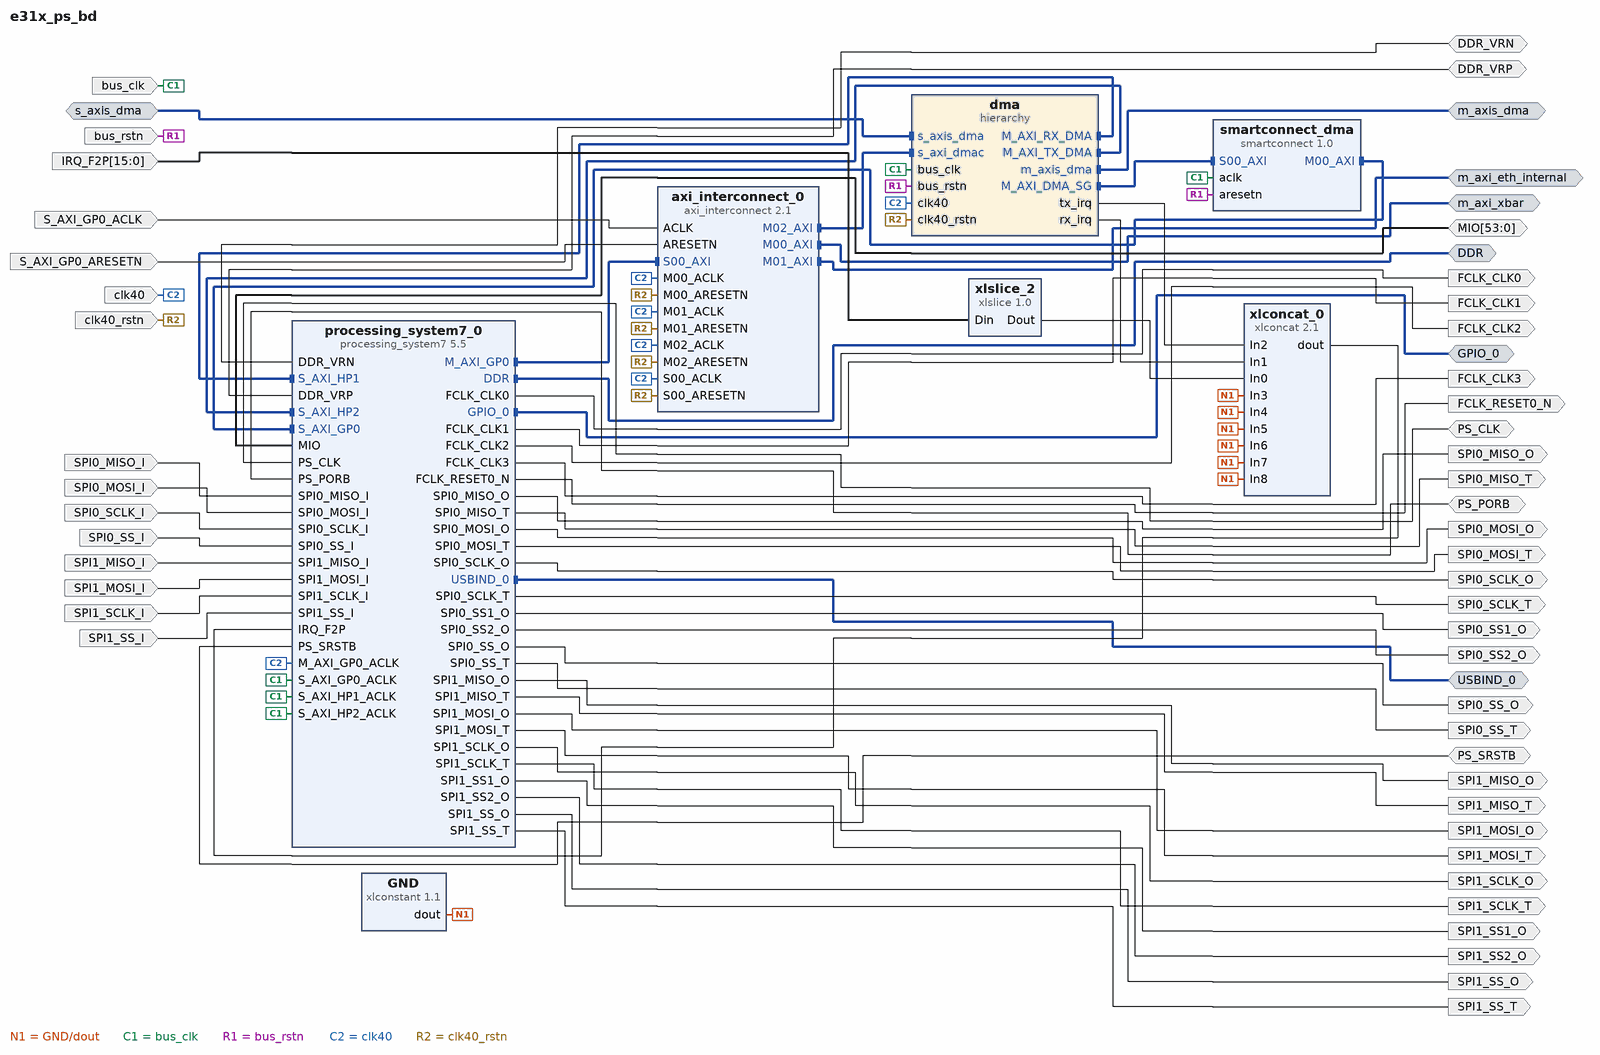
[diagram p0: block diagram of the top level]
# Vivado block design e31x_ps_bd, xc7z020clg400-2, Vivado 2022.2
create_bd_design e31x_ps_bd

create_bd_intf_port -mode Master -vlnv xilinx.com:interface:ddrx_rtl:1.0 DDR
create_bd_intf_port -mode Master -vlnv xilinx.com:interface:gpio_rtl:1.0 GPIO_0
create_bd_intf_port -mode Master -vlnv xilinx.com:display_processing_system7:usbctrl_rtl:1.0 USBIND_0
create_bd_intf_port -mode Master -vlnv xilinx.com:interface:aximm_rtl:1.0 m_axi_eth_internal
set_property -dict [list \
  CONFIG.ADDR_WIDTH 31 \
  CONFIG.DATA_WIDTH 32 \
  CONFIG.FREQ_HZ 40000000 \
  CONFIG.HAS_BURST 0 \
  CONFIG.HAS_CACHE 0 \
  CONFIG.HAS_LOCK 0 \
  CONFIG.HAS_PROT 0 \
  CONFIG.HAS_QOS 0 \
  CONFIG.HAS_WSTRB 0 \
  CONFIG.NUM_READ_OUTSTANDING 2 \
  CONFIG.NUM_WRITE_OUTSTANDING 2 \
  CONFIG.PROTOCOL AXI4LITE \
] [get_bd_intf_ports m_axi_eth_internal]
create_bd_intf_port -mode Master -vlnv xilinx.com:interface:aximm_rtl:1.0 m_axi_xbar
set_property -dict [list \
  CONFIG.ADDR_WIDTH 32 \
  CONFIG.DATA_WIDTH 32 \
  CONFIG.FREQ_HZ 40000000 \
  CONFIG.HAS_BURST 0 \
  CONFIG.HAS_CACHE 0 \
  CONFIG.HAS_LOCK 0 \
  CONFIG.HAS_PROT 0 \
  CONFIG.HAS_QOS 0 \
  CONFIG.HAS_WSTRB 0 \
  CONFIG.NUM_READ_OUTSTANDING 2 \
  CONFIG.NUM_WRITE_OUTSTANDING 2 \
  CONFIG.PROTOCOL AXI4LITE \
] [get_bd_intf_ports m_axi_xbar]
create_bd_intf_port -mode Master -vlnv xilinx.com:interface:axis_rtl:1.0 m_axis_dma
set_property -dict {CONFIG.FREQ_HZ 200000000} [get_bd_intf_ports m_axis_dma]
create_bd_intf_port -mode Slave -vlnv xilinx.com:interface:axis_rtl:1.0 s_axis_dma
set_property -dict [list \
  CONFIG.FREQ_HZ 200000000 \
  CONFIG.HAS_TKEEP 0 \
  CONFIG.HAS_TLAST 1 \
  CONFIG.HAS_TREADY 1 \
  CONFIG.HAS_TSTRB 0 \
  CONFIG.LAYERED_METADATA undef \
  CONFIG.TDATA_NUM_BYTES 8 \
  CONFIG.TDEST_WIDTH 4 \
  CONFIG.TID_WIDTH 0 \
  CONFIG.TUSER_WIDTH 0 \
] [get_bd_intf_ports s_axis_dma]
create_bd_port -dir IO DDR_VRN
create_bd_port -dir IO DDR_VRP
create_bd_port -dir O -type clk FCLK_CLK0
create_bd_port -dir O -type clk FCLK_CLK1
create_bd_port -dir O -type clk FCLK_CLK2
create_bd_port -dir O -type clk FCLK_CLK3
create_bd_port -dir O -type rst FCLK_RESET0_N
create_bd_port -dir I -from 15 -to 0 -type intr IRQ_F2P
set_property -dict {CONFIG.PortWidth 16 CONFIG.SENSITIVITY EDGE_RISING} [get_bd_ports IRQ_F2P]
create_bd_port -dir IO -from 53 -to 0 MIO
create_bd_port -dir IO PS_CLK
create_bd_port -dir IO PS_PORB
create_bd_port -dir IO PS_SRSTB
create_bd_port -dir I SPI0_MISO_I
create_bd_port -dir O SPI0_MISO_O
create_bd_port -dir O SPI0_MISO_T
create_bd_port -dir I SPI0_MOSI_I
create_bd_port -dir O SPI0_MOSI_O
create_bd_port -dir O SPI0_MOSI_T
create_bd_port -dir I SPI0_SCLK_I
create_bd_port -dir O SPI0_SCLK_O
create_bd_port -dir O SPI0_SCLK_T
create_bd_port -dir O SPI0_SS1_O
create_bd_port -dir O SPI0_SS2_O
create_bd_port -dir I SPI0_SS_I
create_bd_port -dir O SPI0_SS_O
create_bd_port -dir O SPI0_SS_T
create_bd_port -dir I SPI1_MISO_I
create_bd_port -dir O SPI1_MISO_O
create_bd_port -dir O SPI1_MISO_T
create_bd_port -dir I SPI1_MOSI_I
create_bd_port -dir O SPI1_MOSI_O
create_bd_port -dir O SPI1_MOSI_T
create_bd_port -dir I SPI1_SCLK_I
create_bd_port -dir O SPI1_SCLK_O
create_bd_port -dir O SPI1_SCLK_T
create_bd_port -dir O SPI1_SS1_O
create_bd_port -dir O SPI1_SS2_O
create_bd_port -dir I SPI1_SS_I
create_bd_port -dir O SPI1_SS_O
create_bd_port -dir O SPI1_SS_T
create_bd_port -dir I -type clk S_AXI_GP0_ACLK
set_property -dict {CONFIG.ASSOCIATED_RESET S_AXI_GP0_ARESETN CONFIG.FREQ_HZ 40000000} [get_bd_ports S_AXI_GP0_ACLK]
create_bd_port -dir I -type rst S_AXI_GP0_ARESETN
create_bd_port -dir I -type clk bus_clk
set_property -dict [list \
  CONFIG.ASSOCIATED_BUSIF m_axis_dma:s_axis_dma \
  CONFIG.ASSOCIATED_RESET bus_rstn \
  CONFIG.FREQ_HZ 200000000 \
] [get_bd_ports bus_clk]
create_bd_port -dir I -type rst bus_rstn
create_bd_port -dir I -type clk clk40
set_property -dict [list \
  CONFIG.ASSOCIATED_BUSIF m_axi_xbar:m_axi_eth_internal \
  CONFIG.ASSOCIATED_RESET clk40_rstn \
  CONFIG.FREQ_HZ 40000000 \
] [get_bd_ports clk40]
create_bd_port -dir I -type rst clk40_rstn

create_bd_cell -type hier dma
create_bd_cell -type ip -vlnv xilinx.com:ip:axi_interconnect:2.1 axi_interconnect_0
set_property -dict {CONFIG.ENABLE_ADVANCED_OPTIONS 0 CONFIG.NUM_MI 3} [get_bd_cells axi_interconnect_0]
create_bd_cell -type ip -vlnv xilinx.com:ip:processing_system7:5.5 processing_system7_0
set_property -dict [list \
  CONFIG.PCW_APU_PERIPHERAL_FREQMHZ 1000 \
  CONFIG.PCW_CPU_CPU_6X4X_MAX_RANGE 767 \
  CONFIG.PCW_ENET0_ENET0_IO {MIO 16 .. 27} \
  CONFIG.PCW_ENET0_GRP_MDIO_ENABLE 1 \
  CONFIG.PCW_ENET0_GRP_MDIO_IO {MIO 52 .. 53} \
  CONFIG.PCW_ENET0_PERIPHERAL_ENABLE 1 \
  CONFIG.PCW_ENET0_RESET_ENABLE 0 \
  CONFIG.PCW_ENET_RESET_ENABLE 1 \
  CONFIG.PCW_ENET_RESET_SELECT {Share reset pin} \
  CONFIG.PCW_EN_CLK1_PORT 1 \
  CONFIG.PCW_EN_CLK2_PORT 1 \
  CONFIG.PCW_EN_CLK3_PORT 1 \
  CONFIG.PCW_FCLK_CLK1_BUF TRUE \
  CONFIG.PCW_FCLK_CLK2_BUF TRUE \
  CONFIG.PCW_FCLK_CLK3_BUF TRUE \
  CONFIG.PCW_FPGA0_PERIPHERAL_FREQMHZ 100 \
  CONFIG.PCW_FPGA1_PERIPHERAL_FREQMHZ 40 \
  CONFIG.PCW_FPGA2_PERIPHERAL_FREQMHZ 166.6667 \
  CONFIG.PCW_FPGA3_PERIPHERAL_FREQMHZ 200 \
  CONFIG.PCW_FPGA_FCLK1_ENABLE 1 \
  CONFIG.PCW_FPGA_FCLK2_ENABLE 1 \
  CONFIG.PCW_FPGA_FCLK3_ENABLE 1 \
  CONFIG.PCW_GPIO_EMIO_GPIO_ENABLE 1 \
  CONFIG.PCW_GPIO_EMIO_GPIO_IO 64 \
  CONFIG.PCW_GPIO_MIO_GPIO_ENABLE 1 \
  CONFIG.PCW_GPIO_MIO_GPIO_IO MIO \
  CONFIG.PCW_I2C0_I2C0_IO EMIO \
  CONFIG.PCW_I2C0_PERIPHERAL_ENABLE 1 \
  CONFIG.PCW_I2C_PERIPHERAL_FREQMHZ 127.777779 \
  CONFIG.PCW_I2C_RESET_ENABLE 0 \
  CONFIG.PCW_IRQ_F2P_INTR 1 \
  CONFIG.PCW_PERIPHERAL_BOARD_PRESET None \
  CONFIG.PCW_PRESET_BANK1_VOLTAGE {LVCMOS 1.8V} \
  CONFIG.PCW_QSPI_GRP_SINGLE_SS_ENABLE 1 \
  CONFIG.PCW_QSPI_GRP_SINGLE_SS_IO {MIO 1 .. 6} \
  CONFIG.PCW_QSPI_PERIPHERAL_ENABLE 1 \
  CONFIG.PCW_QSPI_QSPI_IO {MIO 1 .. 6} \
  CONFIG.PCW_SD0_GRP_CD_ENABLE 0 \
  CONFIG.PCW_SD0_GRP_WP_ENABLE 0 \
  CONFIG.PCW_SD0_PERIPHERAL_ENABLE 1 \
  CONFIG.PCW_SD0_SD0_IO {MIO 40 .. 45} \
  CONFIG.PCW_SDIO_PERIPHERAL_FREQMHZ 100 \
  CONFIG.PCW_SINGLE_QSPI_DATA_MODE x4 \
  CONFIG.PCW_SPI0_PERIPHERAL_ENABLE 1 \
  CONFIG.PCW_SPI0_SPI0_IO EMIO \
  CONFIG.PCW_SPI1_PERIPHERAL_ENABLE 1 \
  CONFIG.PCW_SPI1_SPI1_IO EMIO \
  CONFIG.PCW_UART0_PERIPHERAL_ENABLE 1 \
  CONFIG.PCW_UART0_UART0_IO EMIO \
  CONFIG.PCW_UART1_PERIPHERAL_ENABLE 1 \
  CONFIG.PCW_UART1_UART1_IO {MIO 48 .. 49} \
  CONFIG.PCW_UART_PERIPHERAL_FREQMHZ 100 \
  CONFIG.PCW_UIPARAM_DDR_FREQ_MHZ 533.333333 \
  CONFIG.PCW_UIPARAM_DDR_PARTNO {MT41K256M16 RE-125} \
  CONFIG.PCW_USB0_PERIPHERAL_ENABLE 1 \
  CONFIG.PCW_USB0_RESET_ENABLE 1 \
  CONFIG.PCW_USB0_RESET_IO {MIO 46} \
  CONFIG.PCW_USB0_USB0_IO {MIO 28 .. 39} \
  CONFIG.PCW_USB_RESET_ENABLE 1 \
  CONFIG.PCW_USB_RESET_SELECT {Share reset pin} \
  CONFIG.PCW_USE_FABRIC_INTERRUPT 1 \
  CONFIG.PCW_USE_HIGH_OCM 1 \
  CONFIG.PCW_USE_PS_SLCR_REGISTERS 1 \
  CONFIG.PCW_USE_S_AXI_GP0 1 \
  CONFIG.PCW_USE_S_AXI_HP1 1 \
  CONFIG.PCW_USE_S_AXI_HP2 1 \
] [get_bd_cells processing_system7_0]
# 518 more settings of processing_system7_0 are not shown: defaults, MIO pin electricals, DDR timing, and values the tool derives
create_bd_cell -type ip -vlnv xilinx.com:ip:smartconnect:1.0 smartconnect_dma
set_property -dict {CONFIG.NUM_SI 1} [get_bd_cells smartconnect_dma]
create_bd_cell -type ip -vlnv xilinx.com:ip:xlconcat:2.1 xlconcat_0
set_property -dict {CONFIG.IN0_WIDTH 8 CONFIG.NUM_PORTS 9 CONFIG.dout_width 16} [get_bd_cells xlconcat_0]
create_bd_cell -type ip -vlnv xilinx.com:ip:xlslice:1.0 xlslice_2
set_property -dict {CONFIG.DIN_FROM 7 CONFIG.DIN_TO 0 CONFIG.DIN_WIDTH 16 CONFIG.DOUT_WIDTH 8} [get_bd_cells xlslice_2]
create_bd_cell -type ip -vlnv xilinx.com:ip:xlconstant:1.1 GND

# ---- hierarchy /dma ----
current_bd_instance /dma
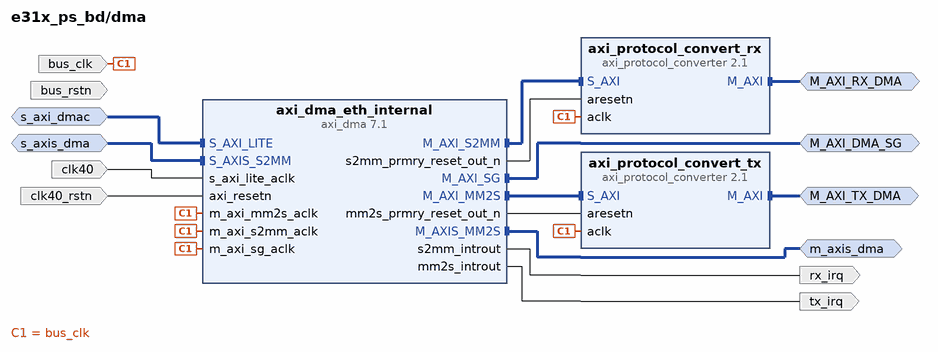
[diagram p1: block diagram inside /dma]
create_bd_intf_pin -mode Master -vlnv xilinx.com:interface:aximm_rtl:1.0 M_AXI_DMA_SG
create_bd_intf_pin -mode Master -vlnv xilinx.com:interface:aximm_rtl:1.0 M_AXI_RX_DMA
create_bd_intf_pin -mode Master -vlnv xilinx.com:interface:aximm_rtl:1.0 M_AXI_TX_DMA
create_bd_intf_pin -mode Master -vlnv xilinx.com:interface:axis_rtl:1.0 m_axis_dma
create_bd_intf_pin -mode Slave -vlnv xilinx.com:interface:aximm_rtl:1.0 s_axi_dmac
create_bd_intf_pin -mode Slave -vlnv xilinx.com:interface:axis_rtl:1.0 s_axis_dma
create_bd_pin -dir I bus_clk
create_bd_pin -dir I bus_rstn
create_bd_pin -dir I clk40
create_bd_pin -dir I clk40_rstn
create_bd_pin -dir O rx_irq
create_bd_pin -dir O tx_irq

create_bd_cell -type ip -vlnv xilinx.com:ip:axi_dma:7.1 axi_dma_eth_internal
set_property -dict [list \
  CONFIG.c_enable_multi_channel 0 \
  CONFIG.c_include_mm2s_dre 1 \
  CONFIG.c_include_s2mm_dre 1 \
  CONFIG.c_m_axi_mm2s_data_width 64 \
  CONFIG.c_m_axis_mm2s_tdata_width 64 \
  CONFIG.c_mm2s_burst_size 16 \
  CONFIG.c_s2mm_burst_size 16 \
  CONFIG.c_sg_include_stscntrl_strm 0 \
] [get_bd_cells axi_dma_eth_internal]
create_bd_cell -type ip -vlnv xilinx.com:ip:axi_protocol_converter:2.1 axi_protocol_convert_rx
set_property -dict {CONFIG.TRANSLATION_MODE 0} [get_bd_cells axi_protocol_convert_rx]
create_bd_cell -type ip -vlnv xilinx.com:ip:axi_protocol_converter:2.1 axi_protocol_convert_tx
set_property -dict {CONFIG.TRANSLATION_MODE 0} [get_bd_cells axi_protocol_convert_tx]

# ---- connections ----

current_bd_instance /dma
connect_bd_intf_net -intf_net axi_dma_0_M_AXIS_MM2S [get_bd_intf_pins m_axis_dma] [get_bd_intf_pins axi_dma_eth_internal/M_AXIS_MM2S]
connect_bd_intf_net -intf_net axi_dma_0_M_AXI_MM2S [get_bd_intf_pins axi_dma_eth_internal/M_AXI_MM2S] [get_bd_intf_pins axi_protocol_convert_tx/S_AXI]
connect_bd_intf_net -intf_net axi_dma_0_M_AXI_S2MM [get_bd_intf_pins axi_dma_eth_internal/M_AXI_S2MM] [get_bd_intf_pins axi_protocol_convert_rx/S_AXI]
connect_bd_intf_net [get_bd_intf_pins M_AXI_DMA_SG] [get_bd_intf_pins axi_dma_eth_internal/M_AXI_SG]
connect_bd_intf_net -intf_net axi_protocol_convert_0_M_AXI [get_bd_intf_pins M_AXI_TX_DMA] [get_bd_intf_pins axi_protocol_convert_tx/M_AXI]
connect_bd_intf_net -intf_net axi_protocol_convert_1_M_AXI [get_bd_intf_pins M_AXI_RX_DMA] [get_bd_intf_pins axi_protocol_convert_rx/M_AXI]
connect_bd_intf_net [get_bd_intf_pins s_axi_dmac] [get_bd_intf_pins axi_dma_eth_internal/S_AXI_LITE]
connect_bd_intf_net [get_bd_intf_pins s_axis_dma] [get_bd_intf_pins axi_dma_eth_internal/S_AXIS_S2MM]
connect_bd_net -net axi_dma_0_mm2s_introut [get_bd_pins axi_dma_eth_internal/mm2s_introut] [get_bd_pins tx_irq]
connect_bd_net -net axi_dma_0_s2mm_introut [get_bd_pins axi_dma_eth_internal/s2mm_introut] [get_bd_pins rx_irq]
connect_bd_net -net axi_dma_0_s2mm_prmry_reset_out_n [get_bd_pins axi_dma_eth_internal/s2mm_prmry_reset_out_n] \
  [get_bd_pins axi_protocol_convert_rx/aresetn]
connect_bd_net [get_bd_pins axi_dma_eth_internal/mm2s_prmry_reset_out_n] [get_bd_pins axi_protocol_convert_tx/aresetn]
connect_bd_net [get_bd_pins bus_clk] \
  [get_bd_pins axi_dma_eth_internal/m_axi_sg_aclk] [get_bd_pins axi_dma_eth_internal/m_axi_mm2s_aclk] \
  [get_bd_pins axi_dma_eth_internal/m_axi_s2mm_aclk] [get_bd_pins axi_protocol_convert_rx/aclk] \
  [get_bd_pins axi_protocol_convert_tx/aclk]
connect_bd_net -net clk40_1 [get_bd_pins clk40] [get_bd_pins axi_dma_eth_internal/s_axi_lite_aclk]
connect_bd_net [get_bd_pins clk40_rstn] [get_bd_pins axi_dma_eth_internal/axi_resetn]

current_bd_instance /
connect_bd_intf_net [get_bd_intf_pins axi_interconnect_0/S00_AXI] [get_bd_intf_pins processing_system7_0/M_AXI_GP0]
connect_bd_intf_net [get_bd_intf_ports m_axi_xbar] [get_bd_intf_pins axi_interconnect_0/M00_AXI]
connect_bd_intf_net [get_bd_intf_ports m_axi_eth_internal] [get_bd_intf_pins axi_interconnect_0/M01_AXI]
connect_bd_intf_net [get_bd_intf_pins axi_interconnect_0/M02_AXI] [get_bd_intf_pins dma/s_axi_dmac]
connect_bd_intf_net [get_bd_intf_pins dma/M_AXI_DMA_SG] [get_bd_intf_pins smartconnect_dma/S00_AXI]
connect_bd_intf_net [get_bd_intf_pins dma/M_AXI_RX_DMA] [get_bd_intf_pins processing_system7_0/S_AXI_HP1]
connect_bd_intf_net [get_bd_intf_pins dma/M_AXI_TX_DMA] [get_bd_intf_pins processing_system7_0/S_AXI_HP2]
connect_bd_intf_net [get_bd_intf_ports m_axis_dma] [get_bd_intf_pins dma/m_axis_dma]
connect_bd_intf_net [get_bd_intf_ports DDR] [get_bd_intf_pins processing_system7_0/DDR]
connect_bd_intf_net [get_bd_intf_ports GPIO_0] [get_bd_intf_pins processing_system7_0/GPIO_0]
connect_bd_intf_net [get_bd_intf_ports USBIND_0] [get_bd_intf_pins processing_system7_0/USBIND_0]
connect_bd_intf_net [get_bd_intf_ports s_axis_dma] [get_bd_intf_pins dma/s_axis_dma]
connect_bd_intf_net [get_bd_intf_pins processing_system7_0/S_AXI_GP0] [get_bd_intf_pins smartconnect_dma/M00_AXI]
connect_bd_net [get_bd_pins GND/dout] \
  [get_bd_pins xlconcat_0/In3] [get_bd_pins xlconcat_0/In4] [get_bd_pins xlconcat_0/In5] [get_bd_pins xlconcat_0/In6] \
  [get_bd_pins xlconcat_0/In7] [get_bd_pins xlconcat_0/In8]
connect_bd_net [get_bd_ports IRQ_F2P] [get_bd_pins xlslice_2/Din]
connect_bd_net [get_bd_ports SPI0_MISO_I] [get_bd_pins processing_system7_0/SPI0_MISO_I]
connect_bd_net [get_bd_ports SPI0_MOSI_I] [get_bd_pins processing_system7_0/SPI0_MOSI_I]
connect_bd_net [get_bd_ports SPI0_SCLK_I] [get_bd_pins processing_system7_0/SPI0_SCLK_I]
connect_bd_net [get_bd_ports SPI0_SS_I] [get_bd_pins processing_system7_0/SPI0_SS_I]
connect_bd_net -net SPI1_MISO_I_0_1 [get_bd_ports SPI1_MISO_I] [get_bd_pins processing_system7_0/SPI1_MISO_I]
connect_bd_net -net SPI1_MOSI_I_0_1 [get_bd_ports SPI1_MOSI_I] [get_bd_pins processing_system7_0/SPI1_MOSI_I]
connect_bd_net -net SPI1_SCLK_I_0_1 [get_bd_ports SPI1_SCLK_I] [get_bd_pins processing_system7_0/SPI1_SCLK_I]
connect_bd_net -net SPI1_SS_I_0_1 [get_bd_ports SPI1_SS_I] [get_bd_pins processing_system7_0/SPI1_SS_I]
connect_bd_net [get_bd_ports S_AXI_GP0_ACLK] [get_bd_pins axi_interconnect_0/ACLK]
connect_bd_net [get_bd_ports S_AXI_GP0_ARESETN] [get_bd_pins axi_interconnect_0/ARESETN]
connect_bd_net [get_bd_ports bus_clk] \
  [get_bd_pins dma/bus_clk] [get_bd_pins processing_system7_0/S_AXI_GP0_ACLK] \
  [get_bd_pins processing_system7_0/S_AXI_HP1_ACLK] [get_bd_pins processing_system7_0/S_AXI_HP2_ACLK] \
  [get_bd_pins smartconnect_dma/aclk]
connect_bd_net [get_bd_ports bus_rstn] [get_bd_pins dma/bus_rstn] [get_bd_pins smartconnect_dma/aresetn]
connect_bd_net -net clk40_1 [get_bd_ports clk40] \
  [get_bd_pins dma/clk40] [get_bd_pins axi_interconnect_0/S00_ACLK] [get_bd_pins axi_interconnect_0/M00_ACLK] \
  [get_bd_pins axi_interconnect_0/M01_ACLK] [get_bd_pins axi_interconnect_0/M02_ACLK] \
  [get_bd_pins processing_system7_0/M_AXI_GP0_ACLK]
connect_bd_net [get_bd_ports clk40_rstn] \
  [get_bd_pins dma/clk40_rstn] [get_bd_pins axi_interconnect_0/S00_ARESETN] [get_bd_pins axi_interconnect_0/M00_ARESETN] \
  [get_bd_pins axi_interconnect_0/M01_ARESETN] [get_bd_pins axi_interconnect_0/M02_ARESETN]
connect_bd_net [get_bd_ports DDR_VRN] [get_bd_pins processing_system7_0/DDR_VRN]
connect_bd_net [get_bd_ports DDR_VRP] [get_bd_pins processing_system7_0/DDR_VRP]
connect_bd_net [get_bd_pins dma/tx_irq] [get_bd_pins xlconcat_0/In2]
connect_bd_net [get_bd_ports MIO] [get_bd_pins processing_system7_0/MIO]
connect_bd_net [get_bd_pins processing_system7_0/FCLK_CLK0] [get_bd_ports FCLK_CLK0]
connect_bd_net [get_bd_pins processing_system7_0/FCLK_CLK1] [get_bd_ports FCLK_CLK1]
connect_bd_net [get_bd_pins processing_system7_0/FCLK_CLK2] [get_bd_ports FCLK_CLK2]
connect_bd_net [get_bd_pins processing_system7_0/FCLK_CLK3] [get_bd_ports FCLK_CLK3]
connect_bd_net [get_bd_pins processing_system7_0/FCLK_RESET0_N] [get_bd_ports FCLK_RESET0_N]
connect_bd_net [get_bd_pins processing_system7_0/SPI0_MISO_O] [get_bd_ports SPI0_MISO_O]
connect_bd_net [get_bd_pins processing_system7_0/SPI0_MISO_T] [get_bd_ports SPI0_MISO_T]
connect_bd_net [get_bd_pins processing_system7_0/SPI0_MOSI_O] [get_bd_ports SPI0_MOSI_O]
connect_bd_net [get_bd_pins processing_system7_0/SPI0_MOSI_T] [get_bd_ports SPI0_MOSI_T]
connect_bd_net [get_bd_pins processing_system7_0/SPI0_SCLK_O] [get_bd_ports SPI0_SCLK_O]
connect_bd_net [get_bd_pins processing_system7_0/SPI0_SCLK_T] [get_bd_ports SPI0_SCLK_T]
connect_bd_net [get_bd_pins processing_system7_0/SPI0_SS1_O] [get_bd_ports SPI0_SS1_O]
connect_bd_net [get_bd_pins processing_system7_0/SPI0_SS2_O] [get_bd_ports SPI0_SS2_O]
connect_bd_net [get_bd_pins processing_system7_0/SPI0_SS_O] [get_bd_ports SPI0_SS_O]
connect_bd_net [get_bd_pins processing_system7_0/SPI0_SS_T] [get_bd_ports SPI0_SS_T]
connect_bd_net [get_bd_pins processing_system7_0/SPI1_MISO_O] [get_bd_ports SPI1_MISO_O]
connect_bd_net [get_bd_pins processing_system7_0/SPI1_MISO_T] [get_bd_ports SPI1_MISO_T]
connect_bd_net [get_bd_pins processing_system7_0/SPI1_MOSI_O] [get_bd_ports SPI1_MOSI_O]
connect_bd_net [get_bd_pins processing_system7_0/SPI1_MOSI_T] [get_bd_ports SPI1_MOSI_T]
connect_bd_net [get_bd_pins processing_system7_0/SPI1_SCLK_O] [get_bd_ports SPI1_SCLK_O]
connect_bd_net [get_bd_pins processing_system7_0/SPI1_SCLK_T] [get_bd_ports SPI1_SCLK_T]
connect_bd_net [get_bd_pins processing_system7_0/SPI1_SS1_O] [get_bd_ports SPI1_SS1_O]
connect_bd_net [get_bd_pins processing_system7_0/SPI1_SS2_O] [get_bd_ports SPI1_SS2_O]
connect_bd_net [get_bd_pins processing_system7_0/SPI1_SS_O] [get_bd_ports SPI1_SS_O]
connect_bd_net [get_bd_pins processing_system7_0/SPI1_SS_T] [get_bd_ports SPI1_SS_T]
connect_bd_net [get_bd_ports PS_CLK] [get_bd_pins processing_system7_0/PS_CLK]
connect_bd_net [get_bd_ports PS_PORB] [get_bd_pins processing_system7_0/PS_PORB]
connect_bd_net [get_bd_ports PS_SRSTB] [get_bd_pins processing_system7_0/PS_SRSTB]
connect_bd_net -net rx_dma_irq [get_bd_pins dma/rx_irq] [get_bd_pins xlconcat_0/In1]
connect_bd_net [get_bd_pins xlconcat_0/dout] [get_bd_pins processing_system7_0/IRQ_F2P]
connect_bd_net [get_bd_pins xlslice_2/Dout] [get_bd_pins xlconcat_0/In0]

# ---- address map ----
assign_bd_address -offset 0x00000000 -range 1G -target_address_space [get_bd_addr_spaces dma/axi_dma_eth_internal/Data_MM2S] [get_bd_addr_segs processing_system7_0/S_AXI_HP2/HP2_DDR_LOWOCM]
assign_bd_address -offset 0xFFFC0000 -range 256K -target_address_space [get_bd_addr_spaces dma/axi_dma_eth_internal/Data_MM2S] [get_bd_addr_segs processing_system7_0/S_AXI_HP2/HP2_HIGH_OCM]
assign_bd_address -offset 0x00000000 -range 1G -target_address_space [get_bd_addr_spaces dma/axi_dma_eth_internal/Data_S2MM] [get_bd_addr_segs processing_system7_0/S_AXI_HP1/HP1_DDR_LOWOCM]
assign_bd_address -offset 0xFFFC0000 -range 256K -target_address_space [get_bd_addr_spaces dma/axi_dma_eth_internal/Data_S2MM] [get_bd_addr_segs processing_system7_0/S_AXI_HP1/HP1_HIGH_OCM]
assign_bd_address -offset 0x00000000 -range 1G -target_address_space [get_bd_addr_spaces dma/axi_dma_eth_internal/Data_SG] [get_bd_addr_segs processing_system7_0/S_AXI_GP0/GP0_DDR_LOWOCM]
assign_bd_address -offset 0xFFFC0000 -range 256K -target_address_space [get_bd_addr_spaces dma/axi_dma_eth_internal/Data_SG] [get_bd_addr_segs processing_system7_0/S_AXI_GP0/GP0_HIGH_OCM]
assign_bd_address -offset 0x40010000 -range 16K -target_address_space [get_bd_addr_spaces processing_system7_0/Data] [get_bd_addr_segs m_axi_xbar/Reg]
assign_bd_address -offset 0x40020000 -range 16K -target_address_space [get_bd_addr_spaces processing_system7_0/Data] [get_bd_addr_segs dma/axi_dma_eth_internal/S_AXI_LITE/Reg]
assign_bd_address -offset 0x40030000 -range 16K -target_address_space [get_bd_addr_spaces processing_system7_0/Data] [get_bd_addr_segs m_axi_eth_internal/Reg]

validate_bd_design
save_bd_design
